# Altium schematic sheet RTLS_Node_sch.SchDoc
size A2
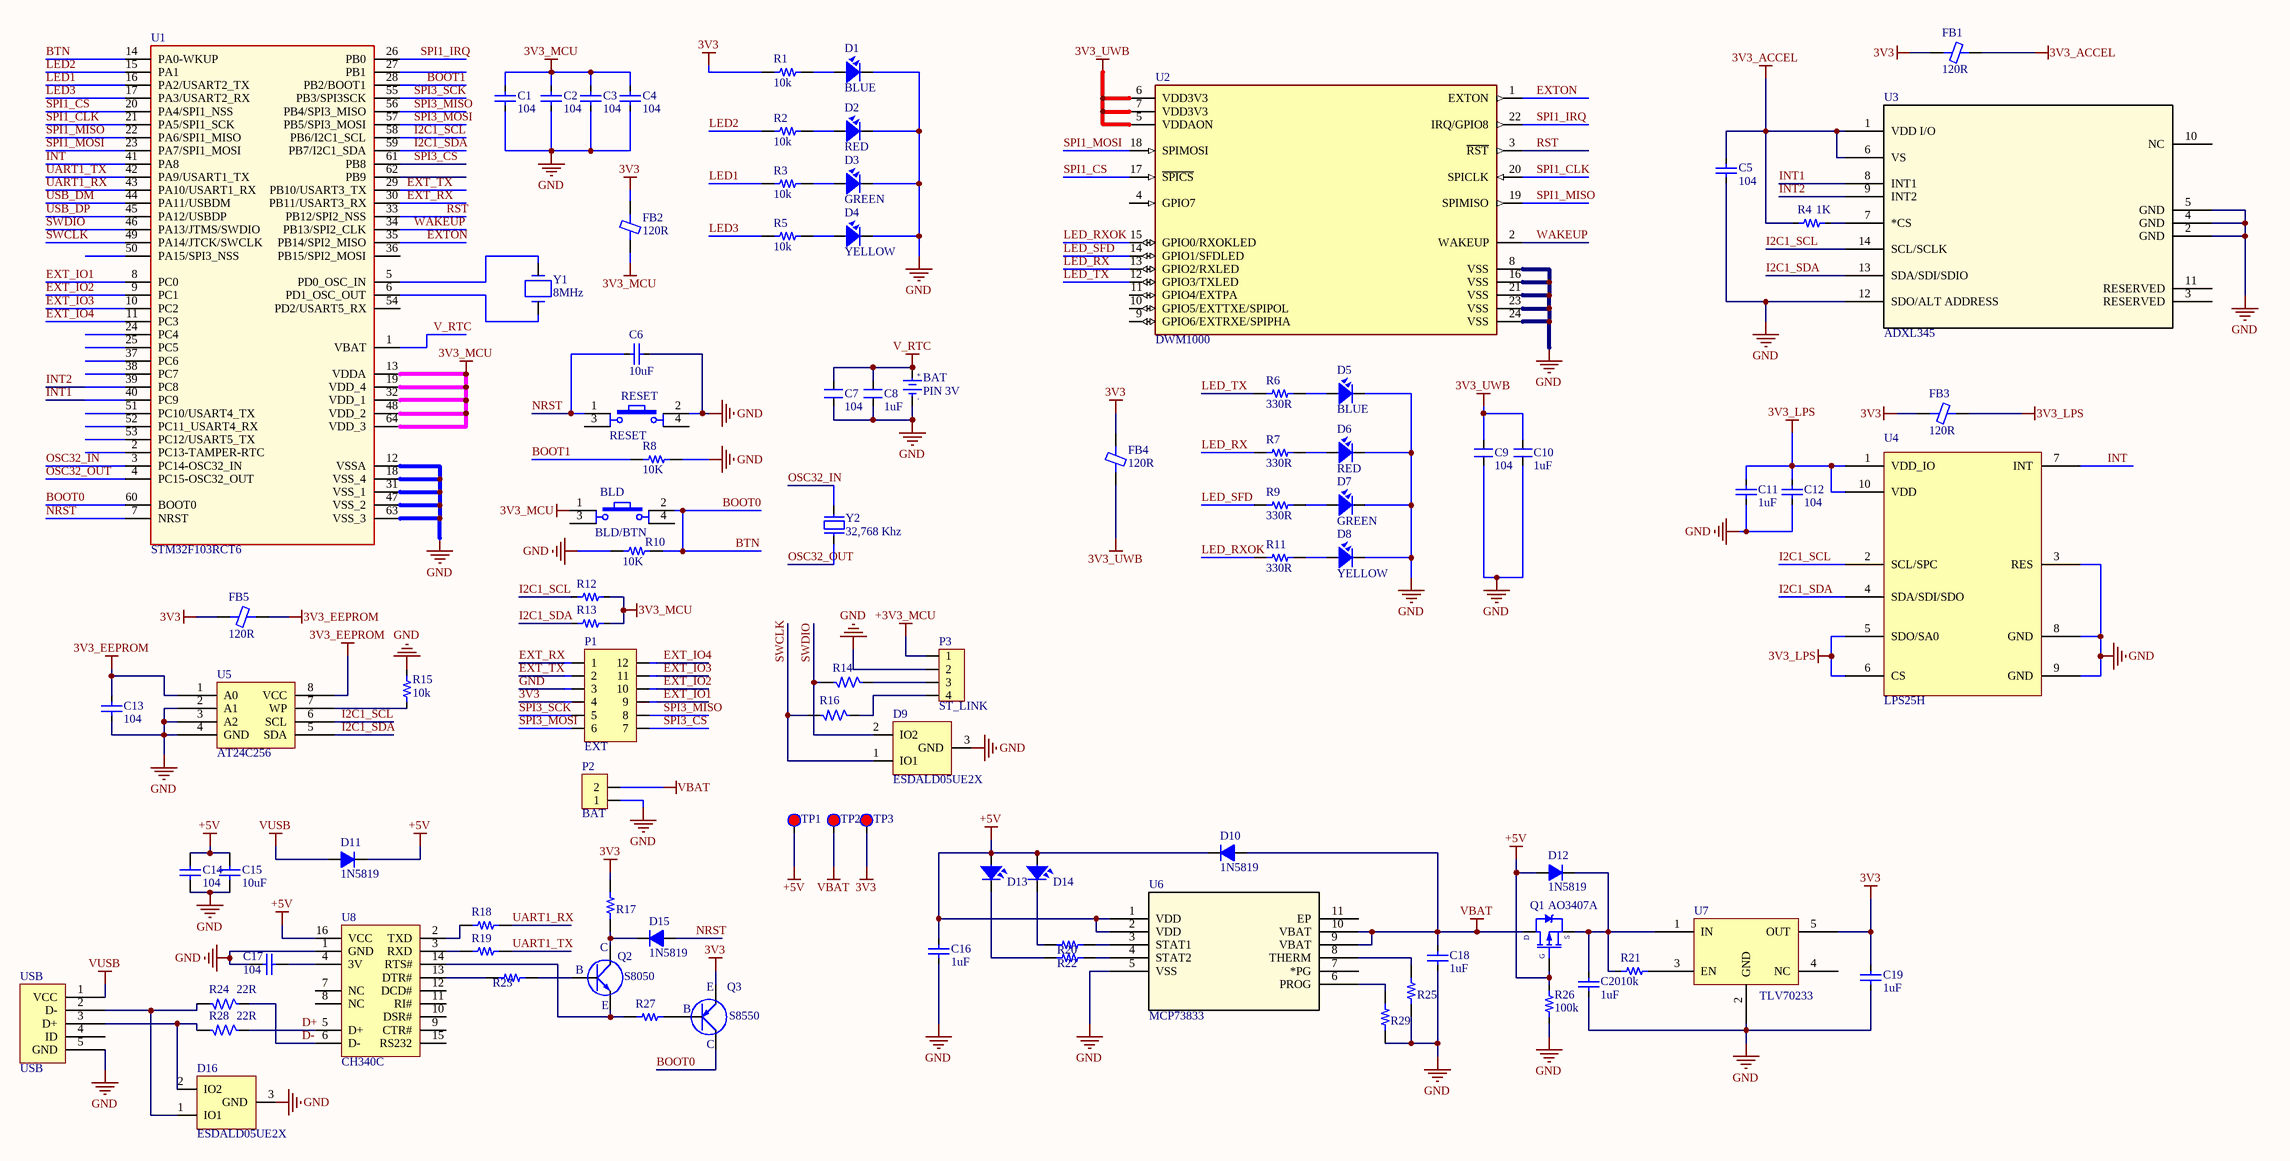
[diagram p0: RTLS_Node_sch.SchDoc]

## Parts
BAT  PIN 3V  [CR1220 SMD]
BLD  BLD/BTN  [SW4 - SMD]
C1  104  [CAP_0603]
C2  104  [CAP_0603]
C3  104  [CAP_0603]
C4  104  [CAP_0603]
C5  104  [CAP_0603]
C6  10uF  [CAP_0603]
C7  104  [CAP_0603]
C8  1uF  [CAP_0603]
C9  104  [CAP_0603]
C10  1uF  [CAP_0603]
C11  1uF  [CAP_0603]
C12  104  [CAP_0603]
C13  104  [CAP_0603]
C14  104  [CAP_0603]
C15  10uF  [CAP_0603]
C16  1uF  [CAP_0603]
C17  104  [CAP_0603]
C18  1uF  [CAP_0603]
C19  1uF  [CAP_0603]
C20  1uF  [CAP_0603]
D1  BLUE  [LED-0603-Red]
D2  RED  [LED-0603-Red]
D3  GREEN  [LED-0603-Green]
D4  YELLOW  [LED-0603-Red]
D5  BLUE  [LED-0603-Green]
D6  RED  [LED-0603-Red]
D7  GREEN  [LED-0603-Green]
D8  YELLOW  [LED-0603-Green]
D9  ESDALD05UE2X  [SOT23]
D10  1N5819  [SOD-123]
D11  1N5819  [SOD-123]
D12  1N5819  [SOD-123]
D13  YELLOW  [LED-0603-Red]  (value not drawn)
D14  YELLOW  [LED-0603-Green]  (value not drawn)
D15  1N5819  [SOD-123]
D16  ESDALD05UE2X  [SOT23]
FB1  120R  [RES-SMD-0603]
FB2  120R  [RES-SMD-0603]
FB3  120R  [RES-SMD-0603]
FB4  120R  [RES-SMD-0603]
FB5  120R  [RES-SMD-0603]
P1  EXT  [JP6-C2T]
P2  BAT  [HEAD2P-1.25]
P3  ST_LINK  [HEADER4P-1.25]
Q1  AO3407A  [AO3407A]
Q2  S8050  [SOT23]
Q3  S8550  [SOT23]
R1  10k  [RES-SMD-0603]
R2  10k  [RES-SMD-0603]
R3  10k  [RES-SMD-0603]
R4  1K  [RES-SMD-0603]
R5  10k  [RES-SMD-0603]
R6  330R  [RES-SMD-0603]
R7  330R  [RES-SMD-0603]
R8  10K  [RES-SMD-0603]
R9  330R  [RES-SMD-0603]
R10  10K  [RES-SMD-0603]
R11  330R  [RES-SMD-0603]
R12  4.7k  [RES-SMD-0603]  (value not drawn)
R13  4.7k  [RES-SMD-0603]  (value not drawn)
R14  10R  [RES-SMD-0603]  (value not drawn)
R15  10k  [RES-SMD-0603]
R16  10R  [RES-SMD-0603]  (value not drawn)
R17  1K  [RES-SMD-0603]  (value not drawn)
R18  1K  [RES-SMD-0603]  (value not drawn)
R19  1K  [RES-SMD-0603]  (value not drawn)
R20  10k  [RES-SMD-0603]  (value not drawn)
R21  10k  [RES-SMD-0603]
R22  10k  [RES-SMD-0603]  (value not drawn)
R23  1K  [RES-SMD-0603]  (value not drawn)
R24  22R  [RES-SMD-0603]
R25  10k  [RES-SMD-0603]  (value not drawn)
R26  100k  [RES-SMD-0603]
R27  1K  [RES-SMD-0603]  (value not drawn)
R28  22R  [RES-SMD-0603]
R29  1k  [RES-SMD-0603]  (value not drawn)
RESET  RESET  [SW4 - SMD]
TP1  Testpoint  [TP1]  (value not drawn)
TP2  Testpoint  [TP1]  (value not drawn)
TP3  Testpoint  [TP1]  (value not drawn)
U1  STM32F103RCT6  [STM32F103RCT6]
U2  DWM1000  [DW1000]
U3  ADXL345  [ADXL345]
U4  LPS25H  [LPS25H]
U5  AT24C256  [SOIC-8]
U6  MCP73833  [MCP73833]
U7  Name: TLV70233  [SOT23-5]  (hidden comment: TLV70223)
U8  CH340C  [SO16]
USB  USB  [Micro Usb]
Y1  8MHz  [ABM7_v1_1_BIG]
Y2  32,768 Khz  [FC135 32.768]

## Nets
3V3: C19.1 FB1.1 FB2.2 FB3.1 FB4.1 FB5.1 P1.4 Q3.2(E) R1.2 R17.2 TP3.1 U7.5(OUT)
3V3_ACCEL: C5.1 FB1.2 R4.2 U3.1(VDD_I/O) U3.6(VS)
3V3_EEPROM: C13.1 FB5.2 U5.1(A0) U5.8(VCC)
3V3_LPS: C11.1 C12.1 FB3.2 U4.1(VDD_IO) U4.5(SDO/SA0) U4.6(CS) U4.10(VDD)
3V3_MCU: BLD.1 C1.2 C2.2 C3.2 C4.2 FB2.1 R12.1 R13.1 U1.13(VDDA) U1.19(VDD_4) U1.32(VDD_1) U1.48(VDD_2) U1.64(VDD_3)
3V3_UWB: C9.2 C10.2 FB4.2 U2.5(VDDAON) U2.6(VDD3V3) U2.7(VDD3V3)
+3V3_MCU: P3.1
+5V: C14.2 C15.2 C16.1 D10.2(K) D11.2(K) D12.1(A) D13.1 D14.1 Q1.1(G) R26.2 TP1.1 U6.1(VDD) U6.2(VDD) U8.16(VCC)
GND: BAT.2(GND) C1.1 C2.1 C3.1 C4.1 C5.2 C6.1 C7.1 C8.1 C9.1 C10.1 C11.2 C12.2 C13.2 C14.1 C15.1 C16.2 C17.1 C18.2 C19.2 C20.2 D1.2 D2.2 D3.2 D4.2 D5.2 D6.2 D7.2 D8.2 D9.3(GND) D16.3(GND) P1.3 P2.1 P3.2 R8.2 R10.1 R15.2 R25.2 R26.1 R29.2 RESET.2 U1.12(VSSA) U1.18(VSS_4) U1.31(VSS_1) U1.47(VSS_2) U1.63(VSS_3) U2.8(VSS) U2.16(VSS) U2.21(VSS) U2.23(VSS) U2.24(VSS) U3.2(GND) U3.4(GND) U3.5(GND) U3.12(SDO/ALT_ADDRESS) U4.3(RES) U4.8(GND) U4.9(GND) U5.2(A1) U5.3(A2) U5.4(GND) U6.5(VSS) U7.2(GND) U8.1(GND) USB.5(GND)
V_RTC: BAT.1(+3V) C7.2 C8.2 U1.1(VBAT)
VBAT: C18.1 D10.1(A) P2.2 Q1.3(D) TP2.1 U6.9(VBAT) U6.10(VBAT)
VUSB: D11.1(A) USB.1(VCC)
BOOT0: BLD.2 Q3.3(C) R10.2 U1.14(PA0-WKUP) U1.60(BOOT0)  [also labelled BTN]
BOOT1: R8.1 U1.28(PB2/BOOT1)
D+: R28.1 U8.5(D+)
D-: R24.1 U8.6(D-)
EXT_IO1: P1.9 U1.8(PC0)
EXT_IO2: P1.10 U1.9(PC1)
EXT_IO3: P1.11 U1.10(PC2)
EXT_IO4: P1.12 U1.11(PC3)
EXT_RX: P1.1 U1.30(PB11/USART3_RX)
EXT_TX: P1.2 U1.29(PB10/USART3_TX)
EXTON: U1.35(PB14/SPI2_MISO) U2.1(EXTON)
I2C1_SCL: R12.2 U1.58(PB6/I2C1_SCL) U3.14(SCL/SCLK) U4.2(SCL/SPC) U5.6(SCL)
I2C1_SDA: R13.2 U1.59(PB7/I2C1_SDA) U3.13(SDA/SDI/SDIO) U4.4(SDA/SDI/SDO) U5.5(SDA)
INT: U1.41(PA8) U4.7(INT)
INT1: U1.40(PC9) U3.8(INT1)
INT2: U1.39(PC8) U3.9(INT2)
LED1: R3.2 U1.16(PA2/USART2_TX)
LED2: R2.2 U1.15(PA1)
LED3: R5.2 U1.17(PA3/USART2_RX)
LED_RX: R7.2 U2.13(GPIO2/RXLED)
LED_RXOK: R11.2 U2.15(GPIO0/RXOKLED)
LED_SFD: R9.2 U2.14(GPIO1/SFDLED)
LED_TX: R6.2 U2.12(GPIO3/TXLED)
NRST: C6.2 D15.1(A) RESET.1 U1.7(NRST)
OSC32_IN: U1.3(PC14-OSC32_IN) Y2.2
OSC32_OUT: U1.4(PC15-OSC32_OUT) Y2.1
RST: U1.33(PB12/SPI2_NSS) U2.3(~{RST})
SPI1_CLK: U1.21(PA5/SPI1_SCK) U2.20(SPICLK)
SPI1_CS: U1.20(PA4/SPI1_NSS) U2.17(~{SPICS})
SPI1_IRQ: U1.26(PB0) U2.22(IRQ/GPIO8)
SPI1_MISO: U1.22(PA6/SPI1_MISO) U2.19(SPIMISO)
SPI1_MOSI: U1.23(PA7/SPI1_MOSI) U2.18(SPIMOSI)
SPI3_CS: P1.7 U1.61(PB8)
SPI3_MISO: P1.8 U1.56(PB4/SPI3_MISO)
SPI3_MOSI: P1.6 U1.57(PB5/SPI3_MOSI)
SPI3_SCK: P1.5 U1.55(PB3/SPI3SCK)
SWCLK: D9.1(IO1) R16.2 U1.49(PA14/JTCK/SWCLK)
SWDIO: D9.2(IO2) R14.2 U1.46(PA13/JTMS/SWDIO)
UART1_RX: R18.2 U1.43(PA10/USART1_RX)
UART1_TX: R19.2 U1.42(PA9/USART1_TX)
USB_DM: U1.44(PA11/USBDM)
USB_DP: U1.45(PA12/USBDP)
WAKEUP: U1.34(PB13/SPI2_CLK) U2.2(WAKEUP)
NetC17_2: C17.2 U8.4(3V)
NetC20_1: C20.1 D12.2(K) Q1.2(S) R21.2 U7.1(IN)
NetD1_1: D1.1 R1.1
NetD2_1: D2.1 R2.1
NetD3_1: D3.1 R3.1
NetD4_1: D4.1 R5.1
NetD5_1: D5.1 R6.1
NetD6_1: D6.1 R7.1
NetD7_1: D7.1 R9.1
NetD8_1: D8.1 R11.1
NetD13_2: D13.2 R22.2
NetD14_2: D14.2 R20.2
NetD15_2: D15.2(K) Q2.3(C) R17.1
NetD16_1: D16.1(IO1) R24.2 USB.2(D-)
NetD16_2: D16.2(IO2) R28.2 USB.3(D+)
NetP3_3: P3.3 R14.1
NetP3_4: P3.4 R16.1
NetQ2_1: Q2.1(B) R23.2
NetQ2_2: Q2.2(E) R27.1 U8.14(RTS#)
NetQ3_1: Q3.1(B) R27.2
NetR4_1: R4.1 U3.7(*CS)
NetR15_1: R15.1 U5.7(WP)
NetR18_1: R18.1 U8.2(TXD)
NetR19_1: R19.1 U8.3(RXD)
NetR20_1: R20.1 U6.3(STAT1)
NetR21_1: R21.1 U7.3(EN)
NetR22_1: R22.1 U6.4(STAT2)
NetR23_1: R23.1 U8.13(DTR#)
NetR25_1: R25.1 U6.8(THERM)
NetR29_1: R29.1 U6.6(PROG)
NetU1_5: U1.5(PD0_OSC_IN) Y1.1
NetU1_6: U1.6(PD1_OSC_OUT) Y1.2

Not connected (* = marked no-connect by the designer): BLD 3 4; RESET 3 4; U1 2(PC13-TAMPER-RTC) 24(PC4) 25(PC5) 27(PB1) 36(PB15/SPI2_MOSI) 37(PC6) 38(PC7) 50(PA15/SPI3_NSS) 51(PC10/USART4_TX) 52(PC11_USART4_RX) 53(PC12/USART5_TX) 54(PD2/USART5_RX) 62(PB9); U2 4(GPIO7) 9(GPIO6/EXTRXE/SPIPHA) 10(GPIO5/EXTTXE/SPIPOL) 11(GPIO4/EXTPA); U3 3(RESERVED) 10(NC) 11(RESERVED); U6 7(*PG) 11(EP); U7 4(NC); U8 7(NC) 8(NC) 9(CTR#) 10(DSR#) 11(RI#) 12(DCD#) 15(RS232); USB 4(ID)

## Notes on the sheet
- (in symbol PIN 3V) +; -

## Library data of the parts
BAT = PIN 3V: Battery 3VDC; Value: PIN 3V
BLD RESET = SW4: Switch button 4 pin; Value: Button chip 4 pin
C1-C6 C11-C20 = CapSMD: Capacitor; Value: 33p; Published: 8-Jun-2000; LatestRevisionDate: 17-Jul-2002; LatestRevisionNote: Re-released for DXP Platform.; PackageReference: RAD-0.3; Publisher: Altium Limited
C7-C10 = CM: Cap SMD; Value: 103
D1-D8 D13 D14 = LED: LED Single colour Green and Red; Value: LED 3 ly Single Colour
D10-D12 D15 = D1A_1: Diode 1A; Value: 1N4007
FB1-FB5 = Ferrite beads
P1 = JP6x2: WR-PHD 2.54 mm Dual Socket Header; Manufacturer: W¨¹rth Elektronik eiSos GmbH; partNo: 61301221821; ComponentLink1 Description: Manufacturer; ComponentLink2 Description: Datasheet; NoPins: 12; Created Date: 29 March 2013; ComponentLink1URL: http://www.we-online.com; ComponentLink2URL: http://katalog.we-online.de/em/datasheet/6130xx21821.pdf; Created by: Karrer Zheng
P2 = Header2: Header IDC, 2 x 1 Pin Vertical 2.54mm Pitch (Non-Boxed, Male); Manufacturer: W¨¹rth Elektronik eiSos GmbH; partNo: 613002143121; ComponentLink1 Description: Manufacturer; ComponentLink2 Description: Datasheet; NoPins: 02; Created Date: 29 March 2013; ComponentLink1URL: http://www.we-online.com; ComponentLink2URL: http://katalog.we-online.de/em/datasheet/6130xx143121.pdf; Created by: Karrer Zheng
P3 = Header4: Header IDC, 4 x 1 Pin Vertical 2.54mm Pitch (Non-Boxed, Male); Manufacturer: W¨¹rth Elektronik eiSos GmbH; partNo: 613002143121; ComponentLink1 Description: Manufacturer; ComponentLink2 Description: Datasheet; NoPins: 02; Created Date: 29 March 2013; ComponentLink1URL: http://www.we-online.com; ComponentLink2URL: http://katalog.we-online.de/em/datasheet/6130xx143121.pdf; Created by: Karrer Zheng
R1-R13 R15 R17-R23 R25-R27 R29 = Resistor - SMD: Resistor; Manufacturer: Generic Components; Class: Passive; Published: 08/06/2000; Publisher: Altium Hobart Technology Centre
R14 R16 R24 R28 = RM: Resistor SMD; Value: 1K
U1 = STM32F103RCT6: STM32F103RCT6 32Bit MCU
U2 = DWM1000: Decawave's DW1000 Ultra / Wideband (UWB) transceiver IC
U3 = ADXL345: 3 Axis Digital Accelerometer
USB = USB_1
Y1 = ABM7-16.000MHZ-D2Y-T: CRYSTAL 16MHZ 18PF SMD; Manufacturer: Abracon LLC; Frequency Stability: ±30ppm; Frequency Tolerance: ±20ppm; ESR (Equivalent Series Resistance): 50 Ohm; Operating Mode: Fundamental; .Creator: MM; .Checked PCB: RF; Supplier 1: Digi-Key; Manufacturer Part Number: ABM7-16.000MHZ-D2Y-T; RoHS: RoHS Compliant; Category: Crystals and Oscillators; Stock 1: 5861; Pricing 1: 1=0.96, 10=0.847, 50=0.791, 100=0.7, 500=0.6615 (USD); Packaging: Cut Tape (CT); Type: MHz Crystal; Frequency: 16MHz; Load Capacitance: 18pF; Operating Temperature: -40°C ~ 85°C; Ratings: -; Mounting Type: Surface Mount; Package / Case: 2-SMD; Size / Dimension: 0.236" L x 0.138" W (6.00mm x 3.50mm); Height: 0.055" (1.40mm); ComponentLink1URL: http://www.abracon.com/Resonators/abm7.pdf; ComponentLink1Description: http://www.abracon.com/Resonators/abm7.pdf; Supplier Part Number 1: 535-9840-1-ND; .Checked SCH: RF
Y2 = XT32k: Crystal 32,768kHz for timer real; Value: 32,768khz
U7 = TLV70223: Package: SOT23-5